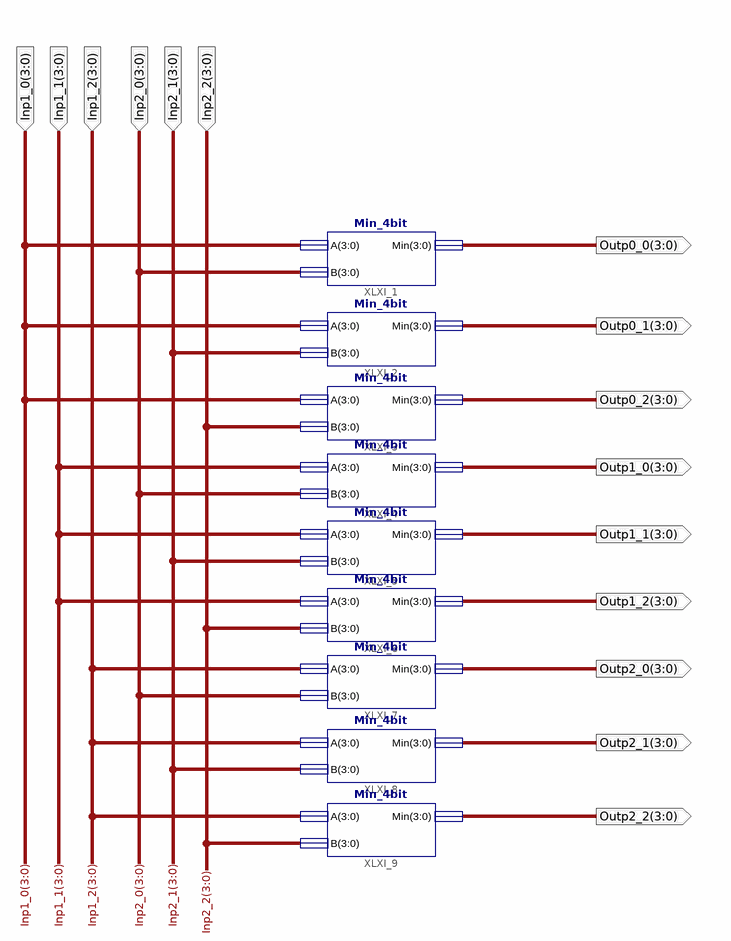
[diagram p0: schematic sheet 1]
// Xilinx ISE schematic Min_Array_3_by_3.sch (spartan3e) as structural Verilog: 9 symbols, 15 ports
module Min_Array_3_by_3 (
  input  [3:0] Inp1_0,
  input  [3:0] Inp1_2,
  input  [3:0] Inp2_0,
  input  [3:0] Inp2_1,
  input  [3:0] Inp2_2,
  input  [3:0] Inp1_1,
  output [3:0] Outp0_0,
  output [3:0] Outp0_1,
  output [3:0] Outp0_2,
  output [3:0] Outp1_0,
  output [3:0] Outp1_1,
  output [3:0] Outp1_2,
  output [3:0] Outp2_0,
  output [3:0] Outp2_1,
  output [3:0] Outp2_2
);

  Min_4bit XLXI_1 (.A(Inp1_0), .B(Inp2_0), .Min(Outp0_0));
  Min_4bit XLXI_2 (.A(Inp1_0), .B(Inp2_1), .Min(Outp0_1));
  Min_4bit XLXI_3 (.A(Inp1_0), .B(Inp2_2), .Min(Outp0_2));
  Min_4bit XLXI_4 (.A(Inp1_1), .B(Inp2_0), .Min(Outp1_0));
  Min_4bit XLXI_5 (.A(Inp1_1), .B(Inp2_1), .Min(Outp1_1));
  Min_4bit XLXI_6 (.A(Inp1_1), .B(Inp2_2), .Min(Outp1_2));
  Min_4bit XLXI_7 (.A(Inp1_2), .B(Inp2_0), .Min(Outp2_0));
  Min_4bit XLXI_8 (.A(Inp1_2), .B(Inp2_1), .Min(Outp2_1));
  Min_4bit XLXI_9 (.A(Inp1_2), .B(Inp2_2), .Min(Outp2_2));
endmodule
